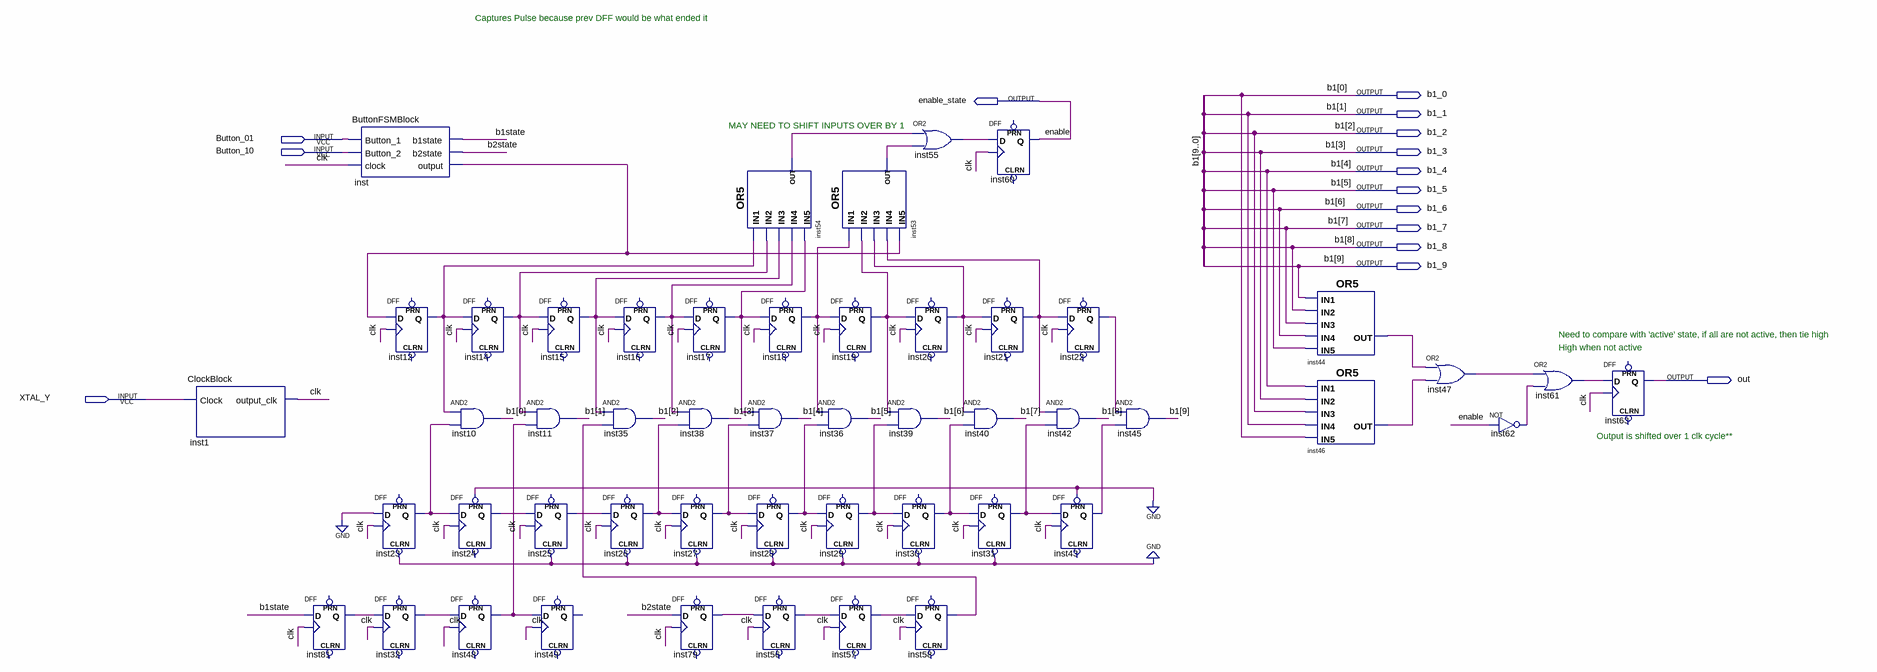
[diagram p0: schematic sheet]
// Quartus schematic tjn_design3.bdf as structural Verilog: 50 symbols, 15 pins
module tjn_design3 (
  input  Button_01,
  input  Button_10,
  input  XTAL_Y,
  output b1_0,
  output enable_state,
  output b1_1,
  output b1_2,
  output b1_3,
  output b1_4,
  output b1_5,
  output b1_6,
  output b1_7,
  output b1_8,
  output b1_9,
  output out
);

  wire b1state, b2state, clk, inst12_q, inst14_q, inst15_q, inst16_q, inst17_q, inst18_q, inst19_q, inst20_q,
       inst21_q, inst22_q, inst23_q, inst24_q, inst25_q, inst26_q, inst27_q, inst28_q, inst29_q, inst30_q,
       inst31_q, inst32_q, inst43_q, inst44_out, inst46_out, inst47_out, inst48_q, inst53_out, inst54_out,
       inst55_out, inst56_q, inst57_q, inst58_q, inst61_out, inst62_out, inst79_q, inst81_q, inst_output;

  ClockBlock inst1 (.Clock(XTAL_Y), .output_clk(clk));
  ButtonFSMBlock inst (
    .Button_1(Button_01), .Button_2(Button_10), .clock(clk), .b1state(b1state), .b2state(b2state),
    .\output (inst_output));
  DFF inst81 (.CLK(clk), .D(b1state), .Q(inst81_q));  // open: CLRN, PRN
  DFF inst12 (.CLK(clk), .D(inst_output), .Q(inst12_q));  // open: CLRN, PRN
  DFF inst23 (.CLRN(1'b0), .CLK(clk), .D(1'b0), .Q(inst23_q));  // open: PRN
  DFF inst32 (.CLK(clk), .D(inst81_q), .Q(inst32_q));  // open: CLRN, PRN
  and inst10 (b1_0, inst12_q, inst23_q);
  DFF inst24 (.CLK(clk), .D(inst23_q), .PRN(1'b0), .Q(inst24_q));  // open: CLRN
  DFF inst48 (.CLK(clk), .D(inst32_q), .Q(inst48_q));  // open: CLRN, PRN
  DFF inst14 (.CLK(clk), .D(inst12_q), .Q(inst14_q));  // open: CLRN, PRN
  DFF inst15 (.CLK(clk), .D(inst14_q), .Q(inst15_q));  // open: CLRN, PRN
  and inst11 (b1_1, inst14_q, inst48_q);
  DFF inst25 (.CLRN(1'b0), .CLK(clk), .D(inst24_q), .Q(inst25_q));  // open: PRN
  DFF inst49 (.CLK(clk), .D(inst48_q));  // open: CLRN, PRN, Q
  and inst35 (b1_2, inst15_q, inst58_q);
  DFF inst26 (.CLRN(1'b0), .CLK(clk), .D(inst25_q), .Q(inst26_q));  // open: PRN
  DFF inst16 (.CLK(clk), .D(inst15_q), .Q(inst16_q));  // open: CLRN, PRN
  DFF inst17 (.CLK(clk), .D(inst16_q), .Q(inst17_q));  // open: CLRN, PRN
  and inst38 (b1_3, inst16_q, inst26_q);
  DFF inst27 (.CLRN(1'b0), .CLK(clk), .D(inst26_q), .Q(inst27_q));  // open: PRN
  DFF inst79 (.CLK(clk), .D(b2state), .Q(inst79_q));  // open: CLRN, PRN
  or inst54 (inst54_out, inst12_q, inst14_q, inst15_q, inst16_q, inst17_q);
  and inst37 (b1_4, inst17_q, inst27_q);
  DFF inst28 (.CLRN(1'b0), .CLK(clk), .D(inst27_q), .Q(inst28_q));  // open: PRN
  DFF inst56 (.CLK(clk), .D(inst79_q), .Q(inst56_q));  // open: CLRN, PRN
  DFF inst18 (.CLK(clk), .D(inst17_q), .Q(inst18_q));  // open: CLRN, PRN
  or inst53 (inst53_out, inst18_q, inst19_q, inst20_q, inst21_q, inst_output);
  DFF inst19 (.CLK(clk), .D(inst18_q), .Q(inst19_q));  // open: CLRN, PRN
  and inst36 (b1_5, inst18_q, inst28_q);
  DFF inst29 (.CLRN(1'b0), .CLK(clk), .D(inst28_q), .Q(inst29_q));  // open: PRN
  DFF inst57 (.CLK(clk), .D(inst56_q), .Q(inst57_q));  // open: CLRN, PRN
  DFF inst20 (.CLK(clk), .D(inst19_q), .Q(inst20_q));  // open: CLRN, PRN
  and inst39 (b1_6, inst19_q, inst29_q);
  DFF inst30 (.CLRN(1'b0), .CLK(clk), .D(inst29_q), .Q(inst30_q));  // open: PRN
  DFF inst58 (.CLK(clk), .D(inst57_q), .Q(inst58_q));  // open: CLRN, PRN
  or inst55 (inst55_out, inst54_out, inst53_out);
  DFF inst60 (.CLK(clk), .D(inst55_out), .Q(enable_state));  // open: CLRN, PRN
  DFF inst21 (.CLK(clk), .D(inst20_q), .Q(inst21_q));  // open: CLRN, PRN
  and inst40 (b1_7, inst20_q, inst30_q);
  DFF inst31 (.CLRN(1'b0), .CLK(clk), .D(inst30_q), .Q(inst31_q));  // open: PRN
  DFF inst22 (.CLK(clk), .D(inst21_q), .Q(inst22_q));  // open: CLRN, PRN
  and inst42 (b1_8, inst21_q, inst31_q);
  DFF inst43 (.CLK(clk), .D(inst31_q), .PRN(1'b0), .Q(inst43_q));  // open: CLRN
  and inst45 (b1_9, inst22_q, inst43_q);
  or inst44 (inst44_out, b1_9, b1_8, b1_7, b1_6, b1_5);
  or inst46 (inst46_out, b1_4, b1_3, b1_2, b1_1, b1_0);
  or inst47 (inst47_out, inst44_out, inst46_out);
  not inst62 (inst62_out, enable_state);
  or inst61 (inst61_out, inst47_out, inst62_out);
  DFF inst63 (.CLK(clk), .D(inst61_out), .Q(out));  // open: CLRN, PRN

  // Other names for the same wires on the sheet: b1[9:0] = {b1_9, b1_8, b1_7, b1_6, b1_5, b1_4, b1_3, b1_2, b1_1, b1_0};
  //   enable = enable_state

  // Notes on the sheet:
  //   Captures Pulse because prev DFF would be what ended it
  //   MAY NEED TO SHIFT INPUTS OVER BY 1
  //   Need to compare with 'active' state, if all are not active, then tie high
  //   High when not active
  //   Output is shifted over 1 clk cycle**
endmodule
